# Altium schematic sheet jn5168_blk.SchDoc
size A4; Date: 1/11/2016; Engineer: JBayalas; DocumentNumber: 9; Revision: V4.3.0; SheetNumber: 9; SheetTotal: 12
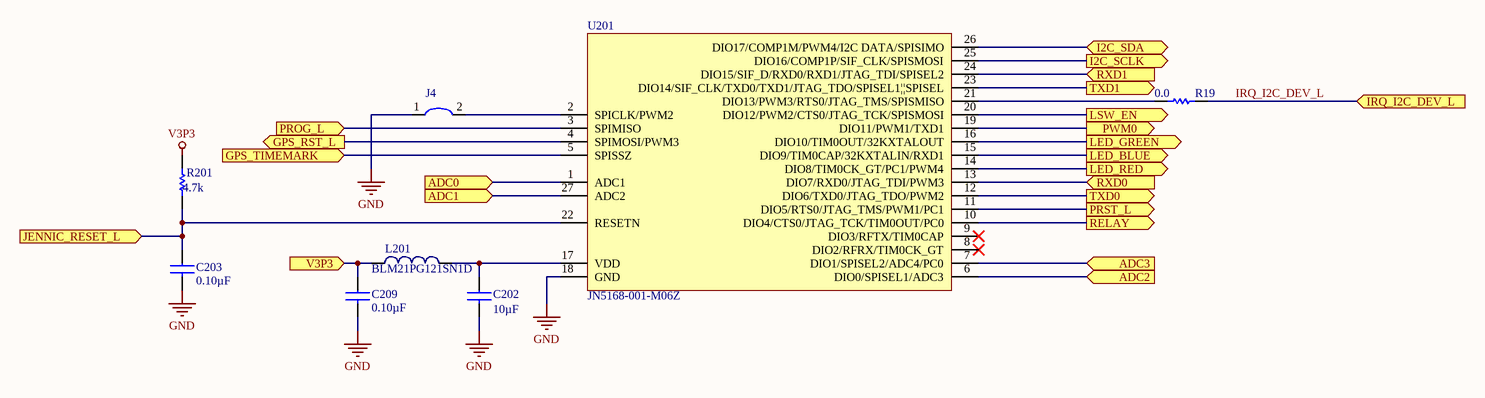
[diagram p0: jn5168_blk.SchDoc]

## Parts
C202  value 10µF  [C1206]  (hidden comment: GRM31CR71C106KAC7L)
C203  value 0.10µF  [C0402]  (hidden comment: GRM155R71H104ME14D)
C209  value 0.10µF  [C0402]  (hidden comment: GRM155R71H104ME14D)
J4  0603 Jumper  [0603 Jumper]  (value not drawn)
L201  BLM21PG121SN1D  [0805 INDUCTOR]
R19  value 0.0  [R0402]  (hidden comment: CRCW04020000Z0ED)
R201  value 4.7k  [R0402]  (hidden comment: ERJ-2RKF4701X)
U201  JN5168-001-M06Z  [JN5168-001-M06Z]

## Ports
ADC0 (in), ADC1 (in), ADC2 (in), ADC3 (in), GPS_RST_L (out), GPS_TIMEMARK (in), I2C_SCLK (out), I2C_SDA (bidir), IRQ_I2C_DEV_L (in), JENNIC_RESET_L (in), LED_BLUE (out), LED_GREEN (out), LED_RED (out), LSW_EN (out), PROG_L (in), PRST_L (out), PWM0 (out), RELAY (out), RXD0 (in), RXD1 (in), TXD0 (out), TXD1 (out), V3P3 (in)

## Nets
GND: C202.2 C203.2 C209.2 J4.1 U201.18(GND)
V3P3: R201.2
ADC0: U201.1(ADC1) ; port ADC0
ADC1: U201.27(ADC2) ; port ADC1
ADC2: U201.6(DIO0/SPISEL1/ADC3) ; port ADC2
ADC3: U201.7(DIO1/SPISEL2/ADC4/PC0) ; port ADC3
GPS_RST_L: U201.4(SPIMOSI/PWM3) ; port GPS_RST_L
GPS_TIMEMARK: U201.5(SPISSZ) ; port GPS_TIMEMARK
I2C_SCLK: U201.25(DIO16/COMP1P/SIF_CLK/SPISMOSI) ; port I2C_SCLK
I2C_SDA: U201.26(DIO17/COMP1M/PWM4/I2C_DATA/SPISIMO) ; port I2C_SDA
IRQ_I2C_DEV_L: R19.2 ; port IRQ_I2C_DEV_L
JENNIC_RESET_L: C203.1 R201.1 U201.22(RESETN) ; port JENNIC_RESET_L
LED_BLUE: U201.15(DIO9/TIM0CAP/32KXTALIN/RXD1) ; port LED_BLUE
LED_GREEN: U201.16(DIO10/TIM0OUT/32KXTALOUT) ; port LED_GREEN
LED_RED: U201.14(DIO8/TIM0CK_GT/PC1/PWM4) ; port LED_RED
LSW_EN: U201.20(DIO12/PWM2/CTS0/JTAG_TCK/SPISMOSI) ; port LSW_EN
PROG_L: U201.3(SPIMISO) ; port PROG_L
PRST_L: U201.11(DIO5/RTS0/JTAG_TMS/PWM1/PC1) ; port PRST_L
PWM0: U201.19(DIO11/PWM1/TXD1) ; port PWM0
RELAY: U201.10(DIO4/CTS0/JTAG_TCK/TIM0OUT/PC0) ; port RELAY
RXD0: U201.13(DIO7/RXD0/JTAG_TDI/PWM3) ; port RXD0
RXD1: U201.24(DIO15/SIF_D/RXD0/RXD1/JTAG_TDI/SPISEL2) ; port RXD1
TXD0: U201.12(DIO6/TXD0/JTAG_TDO/PWM2) ; port TXD0
TXD1: U201.23(DIO14/SIF_CLK/TXD0/TXD1/JTAG_TDO/SPISEL1||SPISEL) ; port TXD1
V3P3: C209.1 L201.2 ; port V3P3  [a separate net that carries the same name]
NetC202_1: C202.1 L201.1 U201.17(VDD)
NetJ4_2: J4.2 U201.2(SPICLK/PWM2)
NetR19_1: R19.1 U201.21(DIO13/PWM3/RTS0/JTAG_TMS/SPISMISO)

Not connected (* = marked no-connect by the designer): U201 8(DIO2/RFRX/TIM0CK_GT)* 9(DIO3/RFTX/TIM0CAP)*

## Notes on the sheet
- Title:
- Sheet:
- Date:
- of
- Project:
- Revision:
- Engineer:
- Wi4B S.r.l

## Library data of the parts
C202 = GRM31CR71C106KAC7L: CAP CER 10UF 16V X7R 1206; MFT: Murata Electronics North America; TYPE: SMD; FUNCTION: Jennic; MPN: GRM31CR71C106KAC7L; RATING: 16V; DNP: *
C203 C209 = GRM155R71H104ME14D: CAP CER 0.1UF 50V X7R 0402; MFT: Murata Electronics North America; TYPE: SMD; FUNCTION: Jennic; MPN: GRM155R71H104ME14D; RATING: 50V; DNP: *
J4 = 0603 Jumper: FUNCTION: Jennic
L201 = BLM21PG121SN1D: FERRITE CHIP 120 OHM 0805; MFT: Murata Electronics North America; RATING: 3A; TYPE: Surface Mount; VALUE: 120 Ohm; FUNCTION: Jennic; MPN: BLM21PG121SN1D
R19 = CRCW04020000Z0ED: RES SMD 0.0OHM JUMPER 1/16W 0402; MFT: Vishay Dale; RATING: 63mW; FUNCTION: Jennic; MPN: CRCW04020000Z0ED; LOAD: *; TYPE: Surface Mount
R201 = ERJ-2RKF4701X: RES SMD 4.7K OHM 1% 1/10W 0402; MFT: Panasonic Electronic Components; RATING: 0.1W, 1/10W; FUNCTION: Jennic; MPN: ERJ-2RKF4701X; TYPE: Surface Mount
U201 = JN5168-001-M06Z: RF TXRX MODULE 802.15.4 U.FL ANT; MFT: NXP USA Inc.; FUNCTION: Jennic; VALUE: JN5168-001-M06Z; TYPE: SMD; RATING: *; DNP: *; MPN: JN5168-001-M06Z